# Altium schematic sheet ZOWI_Main_Board_MCU.SchDoc: MCU
size A4; Date: 20140214; Author: Raúl de Pablos; CompanyName: bq - Mundo Reader; Organization: bq - Mundo Reader; DocumentNumber: 2; Revision: 1.0; SheetNumber: 2; SheetTotal: 9; ProjectName: ZOWI_Main_Board
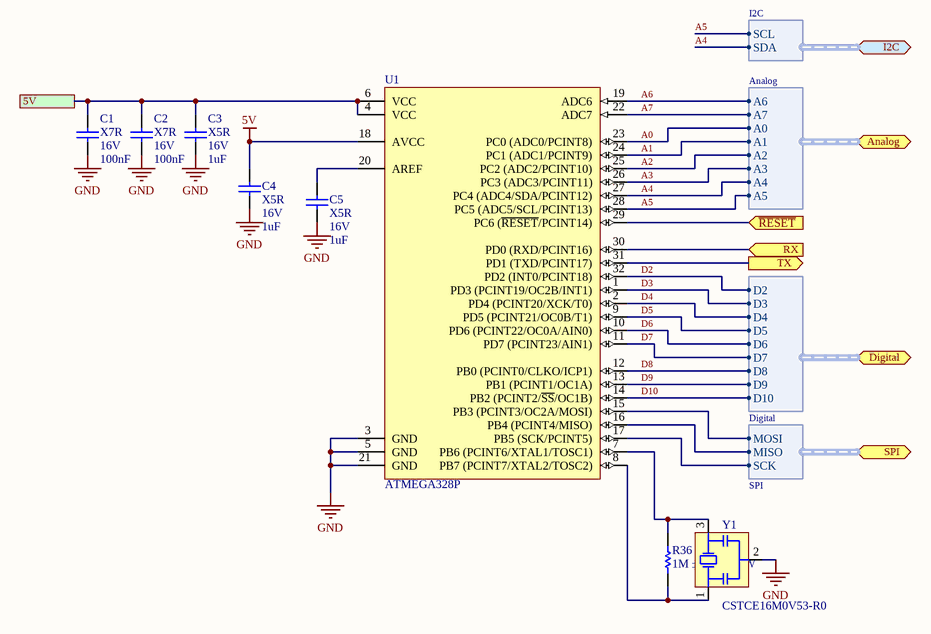
[diagram p0: ZOWI_Main_Board_MCU.SchDoc]

## Parts
C1  Dielectric: X7R  Voltage: 16V  Capacitance: 100nF  [C0402]  (hidden comment: Capacitor)
C2  Dielectric: X7R  Voltage: 16V  Capacitance: 100nF  [C0402]  (hidden comment: Capacitor)
C3  Dielectric: X5R  Voltage: 16V  Capacitance: 1uF  [C0603]  (hidden comment: Capacitor)
C4  Dielectric: X5R  Voltage: 16V  Capacitance: 1uF  [C0603]  (hidden comment: Capacitor)
C5  Dielectric: X5R  Voltage: 16V  Capacitance: 1uF  [C0603]  (hidden comment: Capacitor)
R36  value 1M ±5% 0.063W  [R0402]  (hidden comment: Resistor)
U1  ATMEGA328P  [TQFP32]
Y1  CSTCE16M0V53-R0  [Resonator_1.3x3.2]

## Ports
5V, Analog (harness Analog), Digital (harness Digital), I2C (harness I2C), RX (in), SPI (harness SPI), TX (out), ~{RESET} (in)

## Harnesses
Analog: A6, A7, A0, A1, A2, A3, A4, A5
Digital: D2, D3, D4, D5, D6, D7, D8, D9, D10
SPI: MOSI, MISO, SCK
I2C: SDA, SCL

## Nets
5V: C4.2 U1.18(AVCC)
GND: C1.1 C2.1 C3.1 C4.1 C5.1 U1.3(GND) U1.5(GND) U1.21(GND) Y1.2(GND)
5V: C1.2 C2.2 C3.2 U1.4(VCC) U1.6(VCC) ; port 5V  [a separate net that carries the same name]
A0: U1.23(PC0_(ADC0/PCINT8)) ; port Analog.A0
A1: U1.24(PC1_(ADC1/PCINT9)) ; port Analog.A1
A2: U1.25(PC2_(ADC2/PCINT10)) ; port Analog.A2
A3: U1.26(PC3_(ADC3/PCINT11)) ; port Analog.A3
A4: U1.27(PC4_(ADC4/SDA/PCINT12)) ; port Analog.A4, port I2C.SDA
A5: U1.28(PC5_(ADC5/SCL/PCINT13)) ; port Analog.A5, port I2C.SCL
A6: U1.19(ADC6) ; port Analog.A6
A7: U1.22(ADC7) ; port Analog.A7
D2: U1.32(PD2_(INT0/PCINT18)) ; port Digital.D2
D3: U1.1(PD3_(PCINT19/OC2B/INT1)) ; port Digital.D3
D4: U1.2(PD4_(PCINT20/XCK/T0)) ; port Digital.D4
D5: U1.9(PD5_(PCINT21/OC0B/T1)) ; port Digital.D5
D6: U1.10(PD6_(PCINT22/OC0A/AIN0)) ; port Digital.D6
D7: U1.11(PD7_(PCINT23/AIN1)) ; port Digital.D7
D8: U1.12(PB0_(PCINT0/CLKO/ICP1)) ; port Digital.D8
D9: U1.13(PB1_(PCINT1/OC1A)) ; port Digital.D9
D10: U1.14(PB2_(PCINT2/~{SS}/OC1B)) ; port Digital.D10
~{RESET}: U1.29(PC6_(~{RESET}/PCINT14)) ; port ~{RESET}
RX: U1.30(PD0_(RXD/PCINT16)) ; port RX
TX: U1.31(PD1_(TXD/PCINT17)) ; port TX
NetC5_2: C5.2 U1.20(AREF)
NetR36_1: R36.1 U1.8(PB7_(PCINT7/XTAL2/TOSC2)) Y1.1(OSC1)
NetR36_2: R36.2 U1.7(PB6_(PCINT6/XTAL1/TOSC1)) Y1.3(OSC2)
NetU1_15: U1.15(PB3_(PCINT3/OC2A/MOSI)) ; port SPI.MOSI
NetU1_16: U1.16(PB4_(PCINT4/MISO)) ; port SPI.MISO
NetU1_17: U1.17(PB5_(SCK/PCINT5)) ; port SPI.SCK

## Notes on the sheet
- Title
- Project
- Size:
- Author
- A4
- Number:
- Revision:
- Mundo Reader, S.L. All rights reserved. No part of these pages, either text or image may be used for any purpose other than personal use. Therefore, reproduction, modification, storage in a retrieval system or retransmission, in any form or by any means, electronic, mechanical or otherwise, for reasons other than personal use, is strictly prohibited without prior written permission.
- Date:
- Time:
- Sheet
- of

## Library data of the parts
C1 C2 = C0402_100nF_16V_±10%: Capacitor SMD; Manufacturer: Kemet; Value: 100nF ±10% 16V; Tolerance: ±10%; OrderingCode: C0402C104K4RAC; Temp_ Max: 125; Temp_ Min: -55; Part Number: C0402_100nF_16V_±10%
C3-C5 = C0603_1uF_16V_±10%: Capacitor SMD; Manufacturer: Kemet; Value: 1uF ±10% 16V; Tolerance: ±10%; OrderingCode: C0603C105K4PAC; Temp_ Max: 125; Temp_ Min: -55; Part Number: C0603_1uF_16V_±10%
R36 = R0402_1M_0.063W_±5%: Manufacturer: Vishay; Tolerance: ±5%; OrderingCode: CRCW04021M00JNED; Power: 0.063W; Resistance: 1M; Temp_ Max: 155; Temp_ Min: -55; PackageDescription: SMD; Part Number: R0402_1M_0.063W_±5%
U1 = ATMEGA328P: Processor, 8-bit AVR Microcontroller; Manufacturer: Atmel; OrderingCode: ATMEGA328P-AU; Temp_ Max: 85; Temp_ Min: -40; Part Number: ATMEGA328P
Y1 = CSTCE16M0V53-R0: Resonator 3 pin; Manufacturer: Murata; Temp_ Max: 80; Temp_ Min: -20; Value: 16MHz; Part Number: CSTCE16M0V53-R0; OrderingCode: CSTCE16M0V53-R0